# EasyEDA Pro project ProPrj_Inverted_MAML_6x6_2026-07-06(1).epro, schematic Atomic_triad
Create Date: 2026-06-20; Page Name: P1; Project Name: Inverted_MAML_6x6; Schematic Name: Schematic1; Update Date: 2026-06-20; Company: EasyEDA.com; Page Size: A4; Version: V1.0
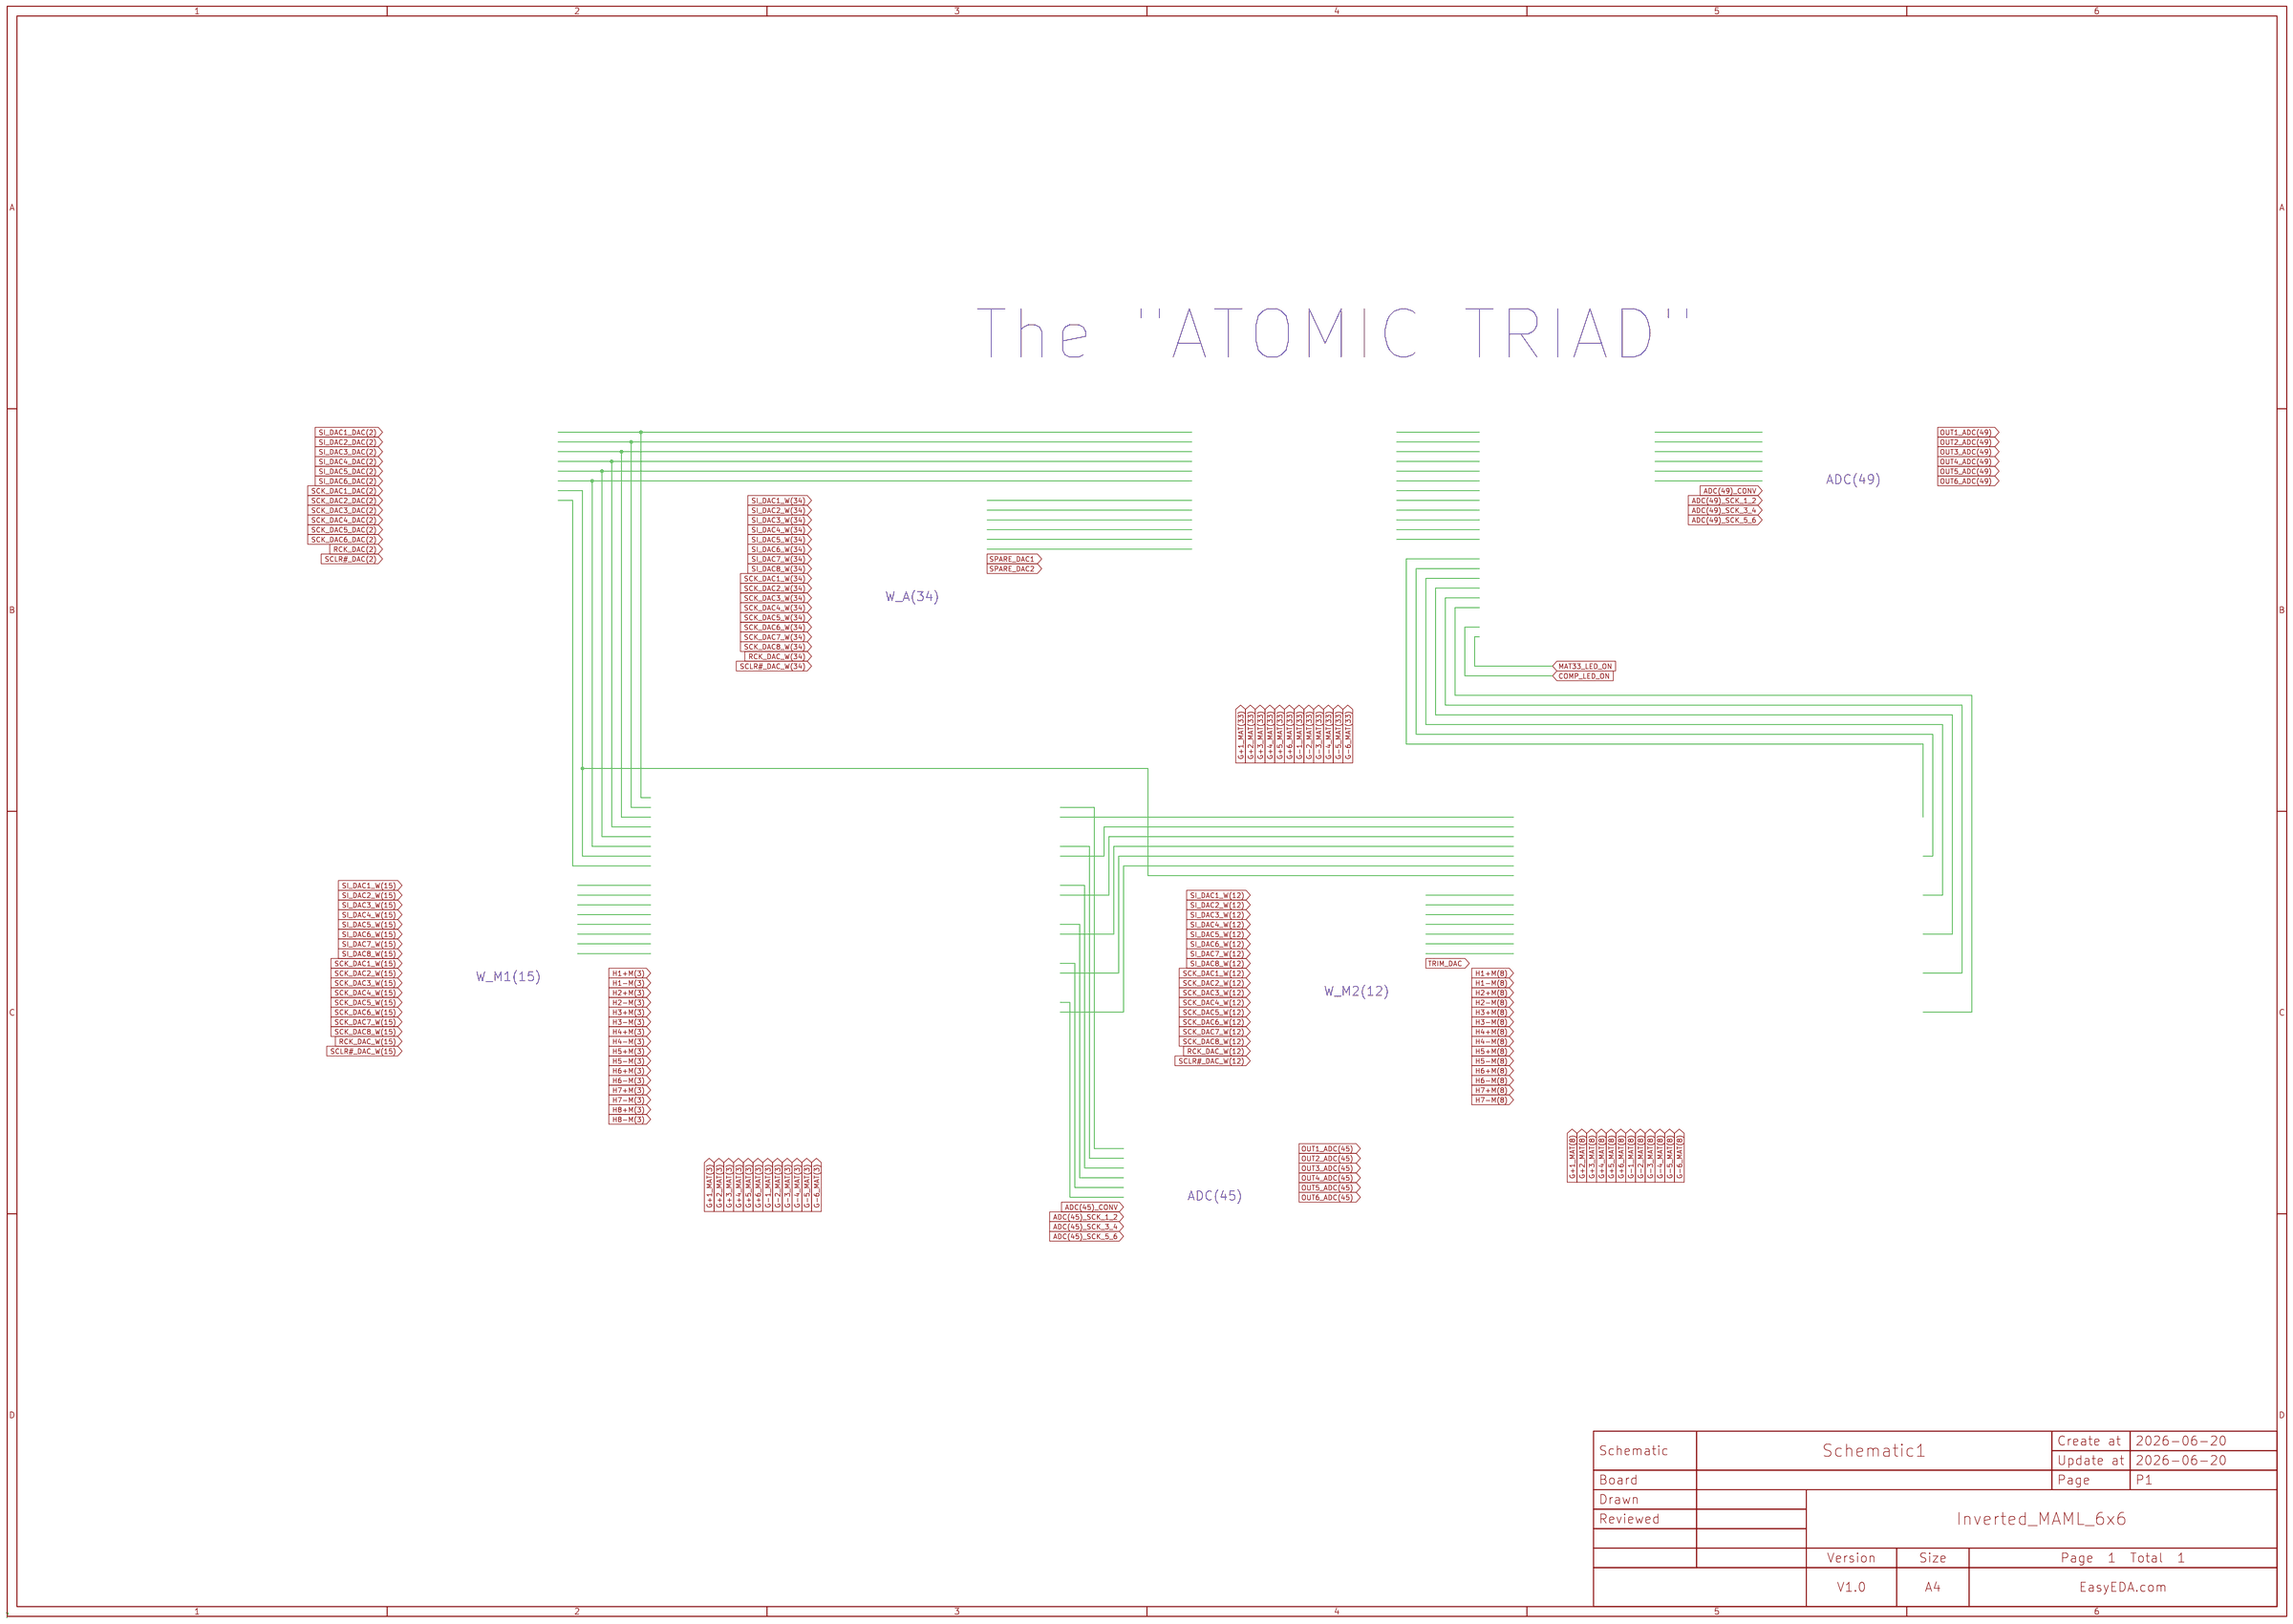
[diagram p5: schematic sheet]

## Parts
CBB1  -
CBB2  -
CBB3  -
CBB4  -
CBB5  -
CBB6  -
CBB7  -
CBB8  -
CBB9  -
CBB10  -
CBB11  -
CBB12  -
CBB13  -
CBB14  -
CBB15  -
CBB16  -
CBB17  -
CBB18  -
CBB19  -
CBB20  -
CBB21  -
CBB49  -

## Nets
ADC(45)_CONV: CBB1.(SIG_OUT_Y) CBB2.(SIG_OUT_Y) CBB3.(SIG_OUT_Y) CBB4.(SIG_OUT_Y) CBB5.(SIG_OUT_Y) CBB6.(SIG_OUT_Y) CBB7.(SCK_5_6) CBB8.(SIG_OUT_Y) CBB9.(IN_BIAS_ROW7) CBB10.(SIG_OUT_Y) CBB11.(SIG_OUT_Y) CBB12.(SIG_OUT_Y) CBB13.(SIG_OUT_Y) CBB14.(SIG_OUT_Y) CBB15.(MAT33_LED_ON) CBB16.(TRIM_REF) CBB17.(DAC_W_ROW8) CBB18.(DAC_W_ROW8) CBB19.(COL-TIA6) CBB20.(DAC_W_ROW8) CBB21.(SCK_5_6) CBB49.(IN_REF_ROW8)

## Notes on the sheet
- The "ATOMIC TRIAD"
- ADC(49)
- W_A(34)
- W_M1(15)
- W_M2(12)
- ADC(45)
